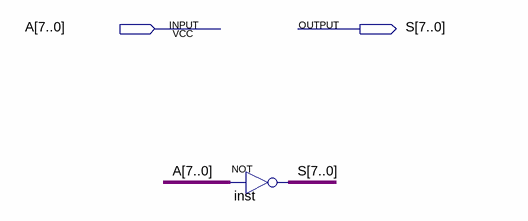
[diagram p0: schematic sheet]
// Quartus schematic NOT8b.bdf as structural Verilog: 1 symbols, 2 pins
module NOT8b (
  input  [7:0] A,
  output [7:0] S
);

  assign S = ~A;  // NOT inst, 8 bits wide
endmodule
